# EAGLE design tinybee_v2 (EAGLE 7.3.0)
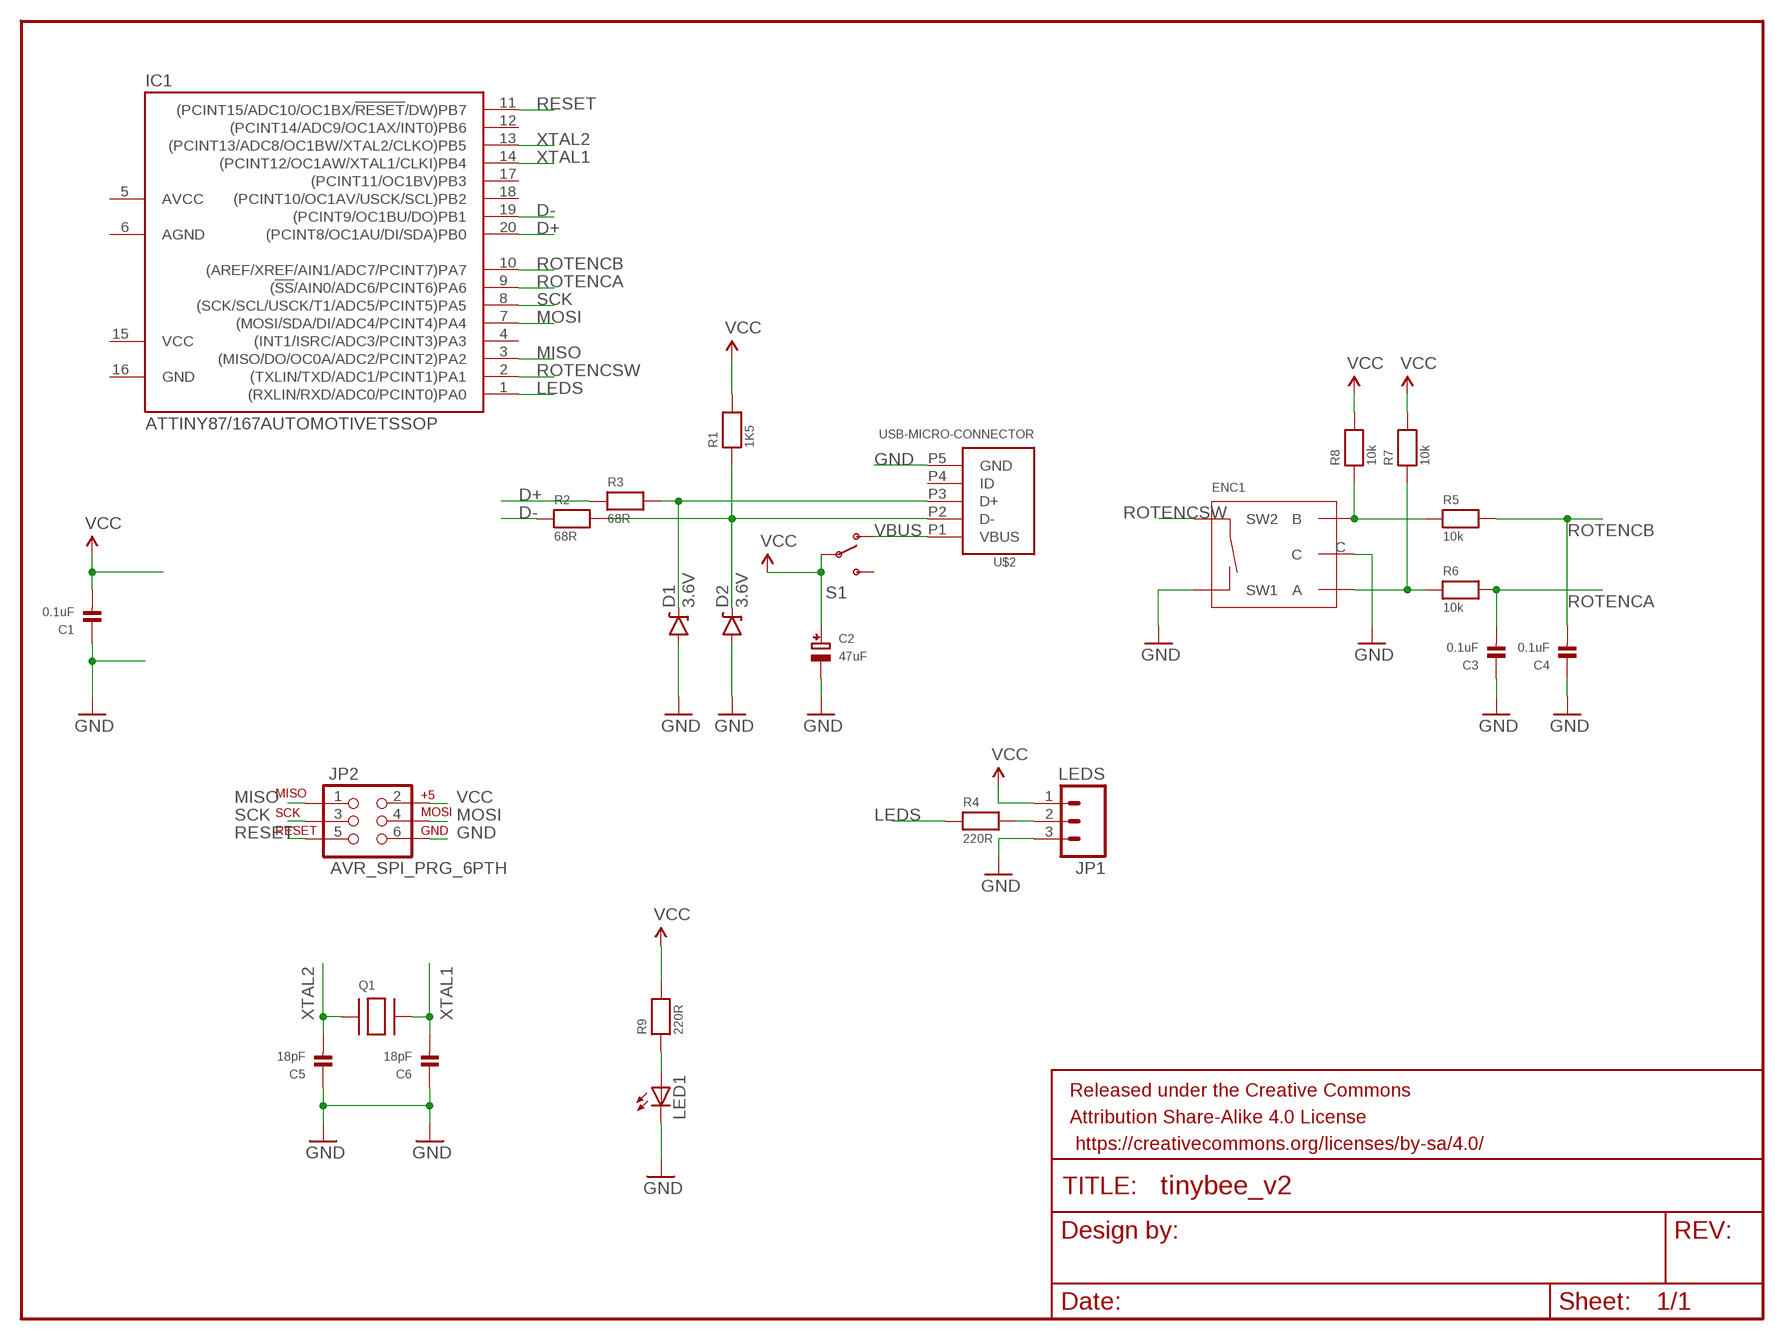
[diagram p0: schematic, sheet 1]

## Parts
C1  0.1uF  CAP_CERAMIC0603  [0603]
C2  47uF  CAP_ELECTROLYTICPANASONIC_C  [PANASONIC_C]
C3  0.1uF  CAP_CERAMIC0603  [0603]
C4  0.1uF  CAP_CERAMIC0603  [0603]
C5  18pF  CAP_CERAMIC0603  [0603]
C6  18pF  CAP_CERAMIC0603  [0603]
D1  3.6V  DIODE-ZENER3.3V  [SOD-323]
D2  3.6V  DIODE-ZENER3.3V  [SOD-323]
ENC1  ROTARY-ENCODER-PEC12R  [ROTARY-ENCODER-PEC12R]
FRAME1  FRAME-LETTER  [CREATIVE_COMMONS]
IC1  ATTINY87/167AUTOMOTIVETSSOP  [TSSOP20]
JP1  LEDS  M03PTH  [1X03]
JP2  AVR_SPI_PRG_6PTH  [2X3]
LED1  LEDCHIPLED_0603  [CHIPLED_0603]
Q1  CRYSTAL  [ABLS7M2]
R1  1K5  RESISTOR0603  [0603]
R2  68R  RESISTOR0603  [0603]
R3  68R  RESISTOR0603  [0603]
R4  220R  RESISTOR0603  [0603]
R5  10k  RESISTOR0603  [0603]
R6  10k  RESISTOR0603  [0603]
R7  10k  RESISTOR0603  [0603]
R8  10k  RESISTOR0603  [0603]
R9  220R  RESISTOR0603  [0603]
S1  SWITCH-SLIDE-SPDT-RIGHTANGLE-500  [SWITCH-SPDT-RIGHTANGLE-500]
U$2  USB-MICRO-CONNECTOR  [DX4R005JJ6/7]

## Nets
D+: IC1.20((PCINT8/OC1AU/DI/SDA)PB0) R3.1
D-: IC1.19((PCINT9/OC1BU/DO)PB1) R2.1
GND: C1.1 C2.- C3.1 C4.1 C5.1 C6.1 D1.A D2.A ENC1.C ENC1.SW1 JP1.3 JP2.6 LED1.C U$2.P5(GND)
LEDS: IC1.1((RXLIN/RXD/ADC0/PCINT0)PA0) R4.1
MISO: IC1.3((MISO/DO/OC0A/ADC2/PCINT2)PA2) JP2.1
MOSI: IC1.7((MOSI/SDA/DI/ADC4/PCINT4)PA4) JP2.4
N$2: D2.C R1.1 R2.2 U$2.P2(D-)
N$3: D1.C R3.2 U$2.P3(D+)
N$4: ENC1.A R6.1 R7.1
N$5: LED1.A R9.1
N$8: ENC1.B R5.1 R8.1
N$11: JP1.2 R4.2
RESET: IC1.11((PCINT15/ADC10/OC1BX/!RESET!/DW)PB7) JP2.5
ROTENCA: C3.2 IC1.9((!SS!/AIN0/ADC6/PCINT6)PA6) R6.2
ROTENCB: C4.2 IC1.10((AREF/XREF/AIN1/ADC7/PCINT7)PA7) R5.2
ROTENCSW: ENC1.SW2 IC1.2((TXLIN/TXD/ADC1/PCINT1)PA1)
SCK: IC1.8((SCK/SCL/USCK/T1/ADC5/PCINT5)PA5) JP2.3
VBUS: S1.SW1 U$2.P1(VBUS)
VCC: C1.2 C2.+ JP1.1 JP2.2 R1.2 R7.2 R8.2 R9.2 S1.SWC(COMMON)
XTAL1: C6.2 IC1.14((PCINT12/OC1AW/XTAL1/CLKI)PB4) Q1.P$2
XTAL2: C5.2 IC1.13((PCINT13/ADC8/OC1BW/XTAL2/CLKO)PB5) Q1.P$1
Unconnected: IC1.4((INT1/ISRC/ADC3/PCINT3)PA3) IC1.5(AVCC) IC1.6(AGND) IC1.12((PCINT14/ADC9/OC1AX/INT0)PB6) IC1.17((PCINT11/OC1BV)PB3) IC1.18((PCINT10/OC1AV/USCK/SCL)PB2) S1.SW2 U$2.P4(ID)

## Power pins joined to a net without a drawn wire
GND: IC1.16(GND)
VCC: IC1.15(VCC)

## Library data of the parts
C1 C3-C6 = microbuilder:CAP_CERAMIC: Ceramic Capacitors 0402 - 0402 Surface Mount Capacitors 16pF 50V 5% [Digikey: 445-4899-2-ND] 18pF 50V 5% [Digikey: 490-1281-2-ND] 22pF 50V 5% [Digikey: 490-1283-2-ND] 68pF 50V 5% [Digikey: 490-1289-2-ND] 0.1uF 10V 10% [Digikey: 490-1318-2-ND] 1.0uF 6.3V 10% [Digikey: 490-1320-2-ND] 0603 - 0603 Surface Mount Capacitors 16 pF 50V 5% [Digikey: 445-5051-2-ND] 22 pF 50V [Digikey: PCC220ACVTR-ND] 33 pF 50V 5% [Digikey: 490-1415-1-ND] 56pF 50V 5% [Digikey: 490-1421-1-ND] 220pF 50V 5% [Digikey: 445-1285-1-ND] 680 pF 50V 2200 pF 50V 5% C0G [Digikey: 445-1297-1-ND] 5600 pF 100V 5% X7R [Digikey: 478-3711-1-ND] 0.1 µF 25V 10% [Digikey: PCC2277TR-ND] 0.22 µF 16V 10% X7R [Digikey: 445-1318-1-ND] 1.0 µF 25V 10% [Digikey: 445-5146-2-ND] 0603 - RF Specific 3pF 250V +/-0.1pF RF [Digikey: 712-1347-1-ND] 18 pF 250V 5% [Digikey: 478-3505-1-ND or 712-1322-1-ND] 56 pF 250V 5% C0G RF [Digikey: 490-4867-1-ND] 68 pF 250V RF [Digikey: 490-4868-1-ND] 0805 - 0805 Surface Mount Capacitors 220 pF 250V 2% RF Ceramic Capacitor [Digikey: 712-1398-1-ND] 1000 pF 50V 2% NP0 Ceramic Capacitor [Digikey: 478-3760-1-ND] 0.1 µF 25V 10% Ceramic Capacitor [Digikey: PCC1828TR-ND] 1.0 µF 16V 10% Ceramic Capacitor[Digikey: 490-1691-2-ND] 10.0 µF 10V 10% Ceramic Capacitor[Digikey: 709-1228-1-ND] 10.0 uF 16V 10% Ceramic Capacitor [Digikey: 478-5165-2-ND] 47 uF 6.3V 20% Ceramic Capacitor [Digikey: 587-1779-1-ND or 399-5506-1-ND] 1206 - 1206 Surface Mount Capacitors 47uF 10V 20% Ceramic Capacitor [Digikey: 490-5528-1-ND or 399-5508-1-ND or 445-6010-1-ND] 100uF 6.3V -20%, +80% Y5V Ceramic Capacitor (Digikey: 490-4512-1-ND, Mouser: 81-GRM31CF50J107ZE1L)
C2 = microbuilder:CAP_ELECTROLYTIC: Electrolytic Capacitors SMT PANASONIC_C - Size C Panasonic Electrolytic Aluminum Capacitor 47µF 16V 20% Electrolytic Capacitor [Digikey: PCE3890TR-ND] PANASONIC_D - Size D Panasonic Electrolytic Aluminum Capacitor 100µF 25V 20% Electrolytic Capacitor [Digikey: PCE3898TR-ND] PTH 3.5 mm grid, 8 mm diameter ... 3.5 mm grid, 10 mm diameter ...
D1 D2 = SparkFun-DiscreteSemi:DIODE-ZENER: Zener Diode Production Part - 8199 3.4V Zener Voltage; PROD_ID: DIO-11284; VALUE: 3.3V
ENC1 = Custom:ROTARY-ENCODER-PEC12R
FRAME1 = SparkFun-Aesthetics:FRAME-LETTER: Schematic Frame Standard 8.5x11 US Letter frame
IC1 = attiny87_167_automotive:ATTINY87/167AUTOMOTIVE
JP1 = SparkFun-Connectors:M03: Header 3 Standard 3-pin 0.1" header. Use with straight break away headers (SKU : PRT-00116), right angle break away headers (PRT-00553), swiss pins (PRT-00743), machine pins (PRT-00117), and female headers (PRT-00115). Molex polarized connector foot print use with SKU : PRT-08232 with associated crimp pins and housings.
JP2 = SparkFun-Connectors:AVR_SPI_PRG_6: AVR ISP 6 Pin This is the reduced ISP connector for AVR programming. Common on Arduino. This footprint will take up less PCB space and can be used with a 10-pin to 6-pin adapter such as SKU: BOB-08508 **Special note about "TEST_POINT" package. The stop mask is on the top side, so if you want your programming test points to be on the bottom of your board, make sure to place this package on the bottom side of the board. This also ensure that the orientation to program from the bottom side will be correct.
LED1 = adafruit:LED: LED OSRAM: - CHIPLED LG R971, LG N971, LY N971, LG Q971, LY Q971, LO R971, LY R971 LH N974, LH R974 LS Q976, LO Q976, LY Q976 LO Q996 - Hyper CHIPLED LW Q18S LB Q993, LB Q99A, LB R99A - SideLED LS A670, LO A670, LY A670, LG A670, LP A670 LB A673, LV A673, LT A673, LW A673 LH A674 LY A675 LS A676, LA A676, LO A676, LY A676, LW A676 LS A679, LY A679, LG A679 - Hyper Micro SIDELED® LS Y876, LA Y876, LO Y876, LY Y876 LT Y87S - SmartLED LW L88C, LW L88S LB L89C, LB L89S, LG L890 LS L89K, LO L89K, LY L89K LS L896, LA L896, LO L896, LY L896 - TOPLED LS T670, LO T670, LY T670, LG T670, LP T670 LSG T670, LSP T670, LSY T670, LOP T670, LYG T670 LG T671, LOG T671, LSG T671 LB T673, LV T673, LT T673, LW T673 LH T674 LS T676, LA T676, LO T676, LY T676, LB T676, LH T676, LSB T676, LW T676 LB T67C, LV T67C, LT T67C, LS T67K, LO T67K, LY T67K, LW E67C LS E67B, LA E67B, LO E67B, LY E67B, LB E67C, LV E67C, LT E67C LW T67C LS T679, LY T679, LG T679 LS T770, LO T770, LY T770, LG T770, LP T770 LB T773, LV T773, LT T773, LW T773 LH T774 LS E675, LA E675, LY E675, LS T675 LS T776, LA T776, LO T776, LY T776, LB T776 LHGB T686 LT T68C, LB T68C - Hyper Mini TOPLED® LB M676 - Mini TOPLED Santana® LG M470 LS M47K, LO M47K, LY M47K Source: http://www.osram.convergy.de/
Q1 = Custom:CRYSTAL
R1-R9 = microbuilder:RESISTOR: Resistors 0402 - 0402 Surface Mount Package 22 Ohm 1% 1/16W [Digikey: 311-22.0LRTR-ND] 33 Ohm 5% 1/16W 1.0K 5% 1/16W 1.5K 5% 1/16W 2.0K 1% 1/16W 10.0K 1% 1/16W [Digikey: 311-10.0KLRTR-ND] 10.0K 5% 1/16W [Digikey: RMCF0402JT10K0TR-ND] 12.1K 1% 1/16W [Digikey: 311-22.0LRTR-ND] 100.0K 5% 1/16W 0603 - 0603 Surface Mount Package 0 Ohm 1/10 Watt 1% Resistor 15 Ohm 1/10 Watt 1% Resistor 33 Ohm 1/10 Watt 1% Resistor 49.9 Ohm 1/10 Watt 1% Resistor 100 Ohm 1/10 Watt 1% Resistor 150 Ohm 1/10 Watt 1% Resistor 240 Ohm 1/10 Watt 1% Resistor 390 Ohm 1/10 Watt 1% Resistor 560 Ohm 1/10 Watt 1% Resistor 680 Ohm 1/10 Watt 1% Resistor 750 Ohm 1/10 Watt 1% Resistor 1.0K Ohm 1/10 Watt 1% Resistor 1.5K Ohm 1/10 Watt 1% Resistor 2.0K Ohm 1/10 Watt 1% Resistor 2.2K Ohm 1/10 Watt 1% Resistor 3.3K Ohm 1/10 Watt 1% Resistor 4.7K Ohm 1/10 Watt 1% Resistor 10.0K Ohm 1/10 Watt 1% Resistor 12.0K Ohm 1/10 Watt 1% Resistor 12.1K Ohm 1/10 Watt 1% Resistor 20.0K Ohm 1/10 Watt 1% Resistor 33.0K Ohm 1/10 Watt 1% Resistor 100.0K Ohm 1/10 Watt 1% Resistor 0805 - 0805 Surface Mount Package 0 Ohm 1/8 Watt 1% Resistor 33 Ohm 1/8 Watt 1% Resistor 100 Ohm 1/8 Watt 1% Resistor 150 Ohm 1/8 Watt 1% Resistor 200 Ohm 1/8 Watt 1% Resistor 240 Ohm 1/8 Watt 1% Resistor 330 Ohm 1/8 Watt 1% Resistor 390 Ohm 1/8 Watt 1% Resistor 470 Ohm 1/8 Watt 1% Resistor 1.0K Ohm 1/8 Watt 1% Resistor 1.5K Ohm 1/8 Watt 1% Resistor 2.0K Ohm 1/8 Watt 1% Resistor 4.7K Ohm 1/8 Watt 1% Resistor 5.1K Ohm 1/8 Watt 1% Resistor 5.6K Ohm 1/8 Watt 1% Resistor 10.0K Ohm 1/8 Watt 1% Resistor 22.0K Ohm 1/8 Watt 1% Resistor 33.0K Ohm 1/8 Watt 1% Resistor 100K Ohm 1/8 Watt 1% Resistor 1206 - 1206 Surface Mount Package 2012 - 2010 Surface Mount Package 0.11 Ohm 1/2 Watt 1% Resistor - Digikey: RHM.11UCT-ND
S1 = Custom:SWITCH-SLIDE-SPDT-RIGHTANGLE-500: https://www.e-switch.com/system/asset/product_line/data_sheet/115/500.pdf
U$2 = Custom:USB-MICRO-CONNECTOR

## Board
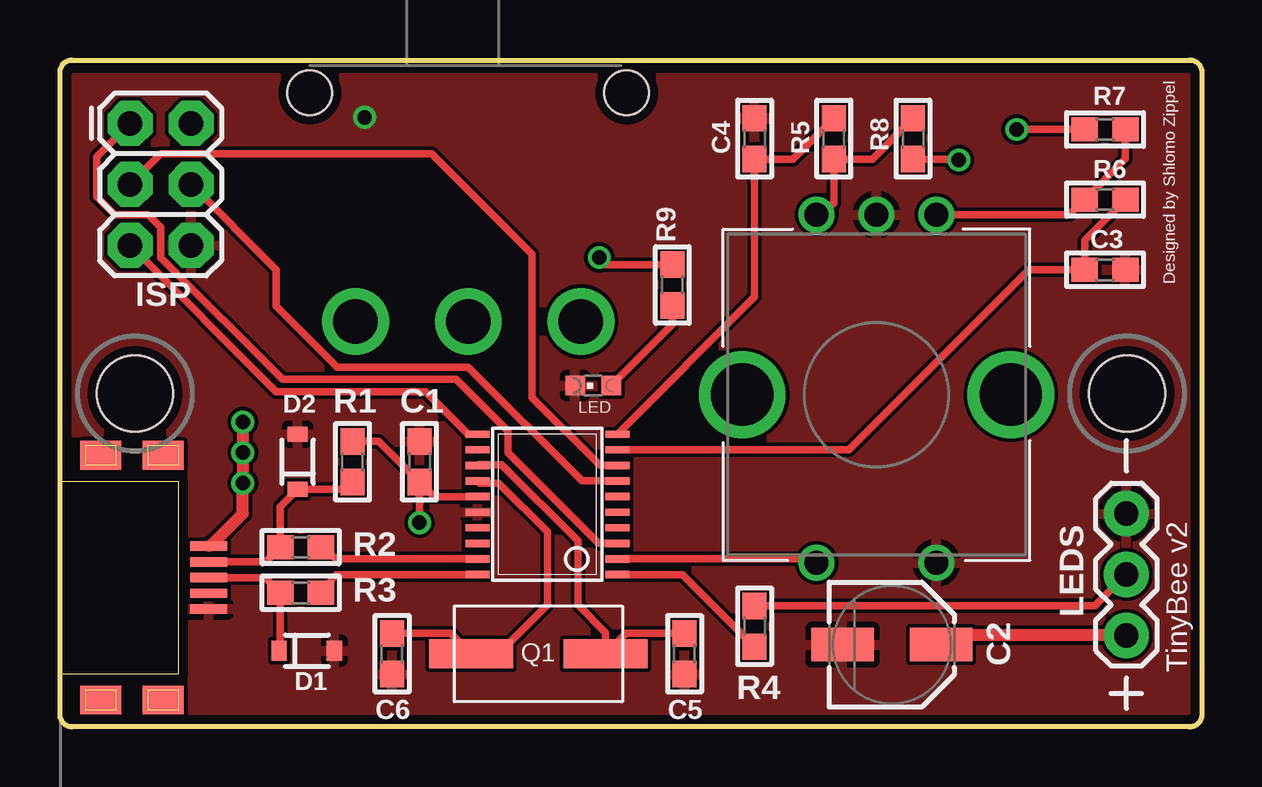
[diagram p1: board, top side]
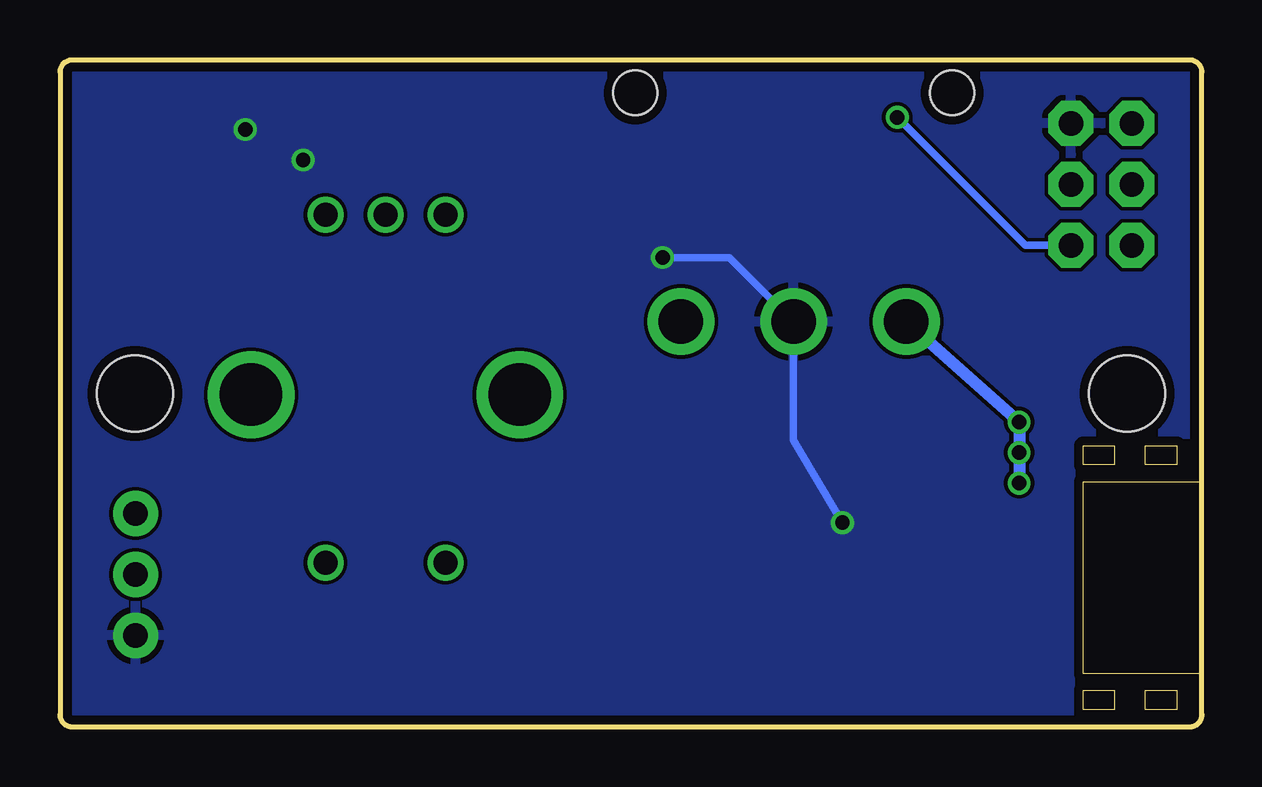
[diagram p2: board, bottom side, seen from below]

Size 47.6 x 27.79 mm. Coordinates in mm from the lower left corner, seen from the top.
Copper layers (1*16): Top 0.0356mm / dielectric 1.5011mm / Bottom 0.0356mm
Design rules "oshpark-2layer": minimum track width 6mil, minimum drill 13mil, track to track 6mil, track to pad 6mil, pad to pad 6mil, via to via 6mil, smd to smd 6mil, copper to edge 15mil, drill to drill 6mil, minimum pad ring 7mil, minimum via ring 7mil, stop-mask expansion 4mil, vias tented up to drill 0mil, thermal gap 10mil

### Footprints (pad centres in the part's own frame; a part is rotated, then mirrored left to right if it is on the bottom)
0603 = smd 1.1 x 1: 1 -0.85,0; 2 0.85,0
PANASONIC_C = smd 2.6 x 1.4: + 2.05,0; - -2.05,0
SOD-323 = smd 0.63 x 0.83: A 1.15,0; C -1.15,0
ROTARY-ENCODER-PEC12R = drill 1: A -2.5,-7.5; B 2.5,-7.5; C 0,-7.5; SW1 -2.5,7; SW2 2.5,7 | drill 2.6: P$1 -5.6,0; P$2 5.6,0
TSSOP20 = smd 0.305 x 0.991: 1 -2.925,-2.918; 2 -2.275,-2.918; 3 -1.625,-2.918; 4 -0.975,-2.918; 5 -0.325,-2.918; 6 0.325,-2.918; 7 0.975,-2.918; 8 1.625,-2.918; 9 2.275,-2.918; 10 2.925,-2.918; 11 2.925,2.918; 12 2.275,2.918; 13 1.625,2.918; 14 0.975,2.918; 15 0.325,2.918; 16 -0.325,2.918; 17 -0.975,2.918; 18 -1.625,2.918; 19 -2.275,2.918; 20 -2.925,2.918
1X03 = drill 1.016 pad 1.88: 1 0,0; 2 2.54,0; 3 5.08,0
2X3 = drill 1.016 pad 1.88 octagon: 1 0,0; 2 0,2.54; 3 2.54,0; 4 2.54,2.54; 5 5.08,0; 6 5.08,2.54
CHIPLED_0603 = smd 0.8 x 0.8: A 0,-0.75; C 0,0.75
ABLS7M2 = smd 3.5 x 1.2: P$1 -2.8,0; P$2 2.8,0
SWITCH-SPDT-RIGHTANGLE-500 = drill 1.854: SW1 -4.699,0; SW2 4.699,0; SWC 0,0 | hole 1.854: -6.604,9.525; 6.604,9.525
FB-30 = hole 3.175: 3.124,13.894; 44.475,13.894
DX4R005JJ6/7 = smd 0.4 x 1.55: P1 -1.31,6.2; P5 1.31,6.2 | smd 0.38 x 1.55: P2 -0.65,6.2; P3 0,6.2; P4 0.65,6.2 | smd 1.2 x 1.7: P$6 -5.1,1.7; P$7 -5.1,4.3; P$8 5.1,4.3; P$9 5.1,1.7

### Placement (x,y rotation side)
C1  14.99,11.05 270 top
C2  34.67,3.43 0 top
C3  43.56,19.05 180 top
C4  28.96,24.51 270 top
C5  26.04,3.05 90 top
C6  13.84,3.05 90 top
D1  10.29,3.17 0 top
D2  9.91,11.05 90 top
ENC1  34.04,13.84 180 top
FRAME1  -101.6,35.56 0 top  (outside the outline)
IC1  20.32,9.27 90 top
JP1  44.45,3.81 90 top
JP2  2.92,25.15 270 top
LED1  22.23,14.22 90 top
Q1  19.94,3.05 180 top
R1  12.19,11.05 90 top
R2  10.03,7.49 180 top
R3  10.03,5.59 180 top
R4  28.96,4.19 90 top
R5  32.26,24.51 90 top
R6  43.56,21.97 0 top
R7  43.56,24.89 180 top
R8  35.56,24.51 270 top
R9  25.53,18.41 90 top
S1  17.02,16.89 0 top
U$1  [FB-30]  0,0 0 top
U$2  0,6.22 270 top

### Tracks (layer width: path | path; a pad name or v marks a point on that pad's centre or on a via)
D+
  Top 0.305: R3.1 11.51,6.35 IC1.20
D-
  Top 0.305: R2.1 11.51,7 IC1.19
GND  (via drill 0.6)
  Bottom 0.305: JP2.6 7.37,20.07 v12.7,25.4
  pour Top: 0.64,27.05 46.99,27.05 46.99,0.51 0.64,0.51
LEDS
  Top 0.305: IC1.1 25.95,6.35 R4.1
MISO
  Top 0.305: IC1.3 22.45,7.65 18.67,11.43 18.67,12.32 16.51,14.48 9.27,14.48 4.19,19.56 4.19,20.83 3.68,21.34 2.29,21.34 1.52,22.1 1.52,23.75 JP2.1
MOSI
  Top 0.305: IC1.7 21.76,10.25 17.02,14.99 11.56,14.99 9.02,17.53 9.02,19.05 JP2.4
N$2
  Top 0.305: R1.1 11.89,9.9 D2.C 9.18,9.18 R2.2 8.56,6.87 U$2.P2
N$3
  Top 0.305: D1.C 9.18,3.48 R3.2 8.55,6.22 U$2.P3
N$4
  Top 0.305: R7.1 44.41,23.67 R6.1 42.08,21.34 ENC1.A
N$5
  Top 0.305: R9.1 25.53,16.78 LED1.A
N$8
  Top 0.305: R8.1 33.86,23.66 R5.1 32.26,21.81 ENC1.B
N$11
  Top 0.305: R4.2 43.14,5.04 JP1.2
RESET
  Top 0.305: IC1.11 17.01,12.2 15.24,13.97 9.02,13.97 JP2.5
ROTENCA
  Top 0.305: R6.2 42.71,20.27 C3.2 40.39,19.05 32.89,11.56 IC1.9
ROTENCB
  Top 0.305: R5.2 30.56,23.66 C4.2 28.96,17.91 IC1.10
ROTENCSW
  Top 0.305: ENC1.SW2 31.38,7 IC1.2
SCK
  Top 0.305: IC1.8 22.5,10.9 19.68,13.72 19.68,19.68 15.49,23.88 4.19,23.88 JP2.3
VBUS  (via drill 0.6)
  Top 0.508: U$2.P1 6.39,7.66 7.62,8.89 v7.62,10.16 v7.62,11.43 v7.62,12.7
  Bottom 0.508: S1.SW1 v7.62,12.7 v7.62,10.16
VCC  (via drill 0.6)
  Top 0.305: R8.2 37.43,23.66 v37.47,23.62 | R7.2 v39.88,24.89 | C1.2 15.59,9.6 IC1.15 | R1.2 13.29,11.9 C1.2 | v22.48,19.56 22.77,19.27 R9.2 | v14.99,8.51 C1.2
  Top 0.508: JP1.1 37.1,3.81 C2.+
  Bottom 0.305: v14.99,8.51 17.02,11.94 S1.SWC 19.68,19.56 v22.48,19.56
  pour Bottom: 0.64,27.18 46.99,27.18 46.99,0.51 0.64,0.51
XTAL1
  Top 0.305: C6.2 16.29,3.9 Q1.P$2 18.29,3.05 20.32,5.08 20.32,8.13 18.29,10.16 17.49,10.16 IC1.14
XTAL2
  Top 0.305: C5.2 23.59,3.9 Q1.P$1 22.74,3.93 21.59,5.08 21.59,7.75 18.41,10.92 17.43,10.92 IC1.13

### Text on the board
tPlace: R7 | Designed by Shlomo Zippel | C4 | R5 | R8 | R6 | C3 | ISP | D2 | R1 | C1 | LED | R2 | R3 | LEDS | C2 | D1 | TinyBee v2 | R4